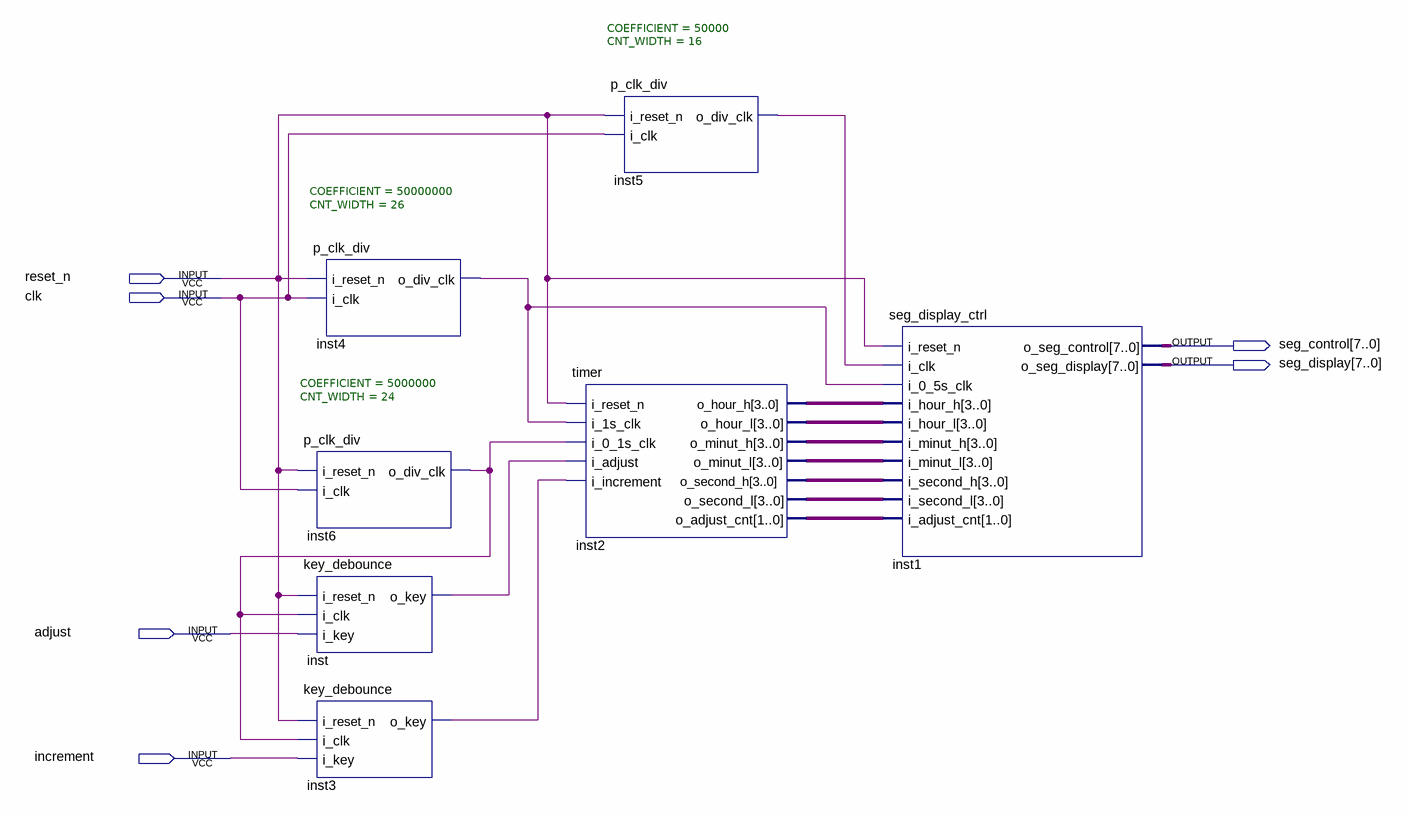
[diagram p0: schematic sheet]
// Quartus schematic seg_clock_top.bdf as structural Verilog: 7 symbols, 6 pins
module seg_clock_top (
  input  reset_n,
  input  clk,
  input  adjust,
  input  increment,
  output [7:0] seg_control,
  output [7:0] seg_display
);

  wire inst3_o_key, inst4_o_div_clk, inst5_o_div_clk, inst6_o_div_clk, inst_o_key;
  wire [1:0] inst2_o_adjust_cnt;
  wire [3:0] inst2_o_hour_h, inst2_o_hour_l, inst2_o_minut_h, inst2_o_minut_l, inst2_o_second_h,
       inst2_o_second_l;

  p_clk_div #(.COEFFICIENT(50000000), .CNT_WIDTH(26)) inst4 (
    .i_reset_n(reset_n), .i_clk(clk), .o_div_clk(inst4_o_div_clk));
  p_clk_div #(.COEFFICIENT(5000000), .CNT_WIDTH(24)) inst6 (
    .i_reset_n(reset_n), .i_clk(clk), .o_div_clk(inst6_o_div_clk));
  key_debounce inst (.i_reset_n(reset_n), .i_clk(inst6_o_div_clk), .i_key(adjust), .o_key(inst_o_key));
  key_debounce inst3 (.i_reset_n(reset_n), .i_clk(inst6_o_div_clk), .i_key(increment), .o_key(inst3_o_key));
  timer inst2 (
    .i_reset_n(reset_n), .i_1s_clk(inst4_o_div_clk), .i_0_1s_clk(inst6_o_div_clk), .i_adjust(inst_o_key),
    .i_increment(inst3_o_key), .o_hour_h(inst2_o_hour_h), .o_hour_l(inst2_o_hour_l),
    .o_minut_h(inst2_o_minut_h), .o_minut_l(inst2_o_minut_l), .o_second_h(inst2_o_second_h),
    .o_second_l(inst2_o_second_l), .o_adjust_cnt(inst2_o_adjust_cnt));
  p_clk_div #(.COEFFICIENT(50000), .CNT_WIDTH(16)) inst5 (
    .i_reset_n(reset_n), .i_clk(clk), .o_div_clk(inst5_o_div_clk));
  seg_display_ctrl inst1 (
    .i_reset_n(reset_n), .i_clk(inst5_o_div_clk), .i_0_5s_clk(inst4_o_div_clk), .i_hour_h(inst2_o_hour_h),
    .i_hour_l(inst2_o_hour_l), .i_minut_h(inst2_o_minut_h), .i_minut_l(inst2_o_minut_l),
    .i_second_h(inst2_o_second_h), .i_second_l(inst2_o_second_l), .i_adjust_cnt(inst2_o_adjust_cnt),
    .o_seg_control(seg_control), .o_seg_display(seg_display));
endmodule
